# EasyEDA Pro project ProPrj_tang25k_YT8531C_V2.0_2026-08-23.epro, schematic DC12DC5
Board Name: DC12DC5; Create Date: 2025-06-27; Page Name: P1; Project Name: tang25k_YT8531C_V2.0; Schematic Name: DC12DC5; Update Date: 2025-06-27; Company: EasyEDA.com; Page Size: A4; Version: V1.0
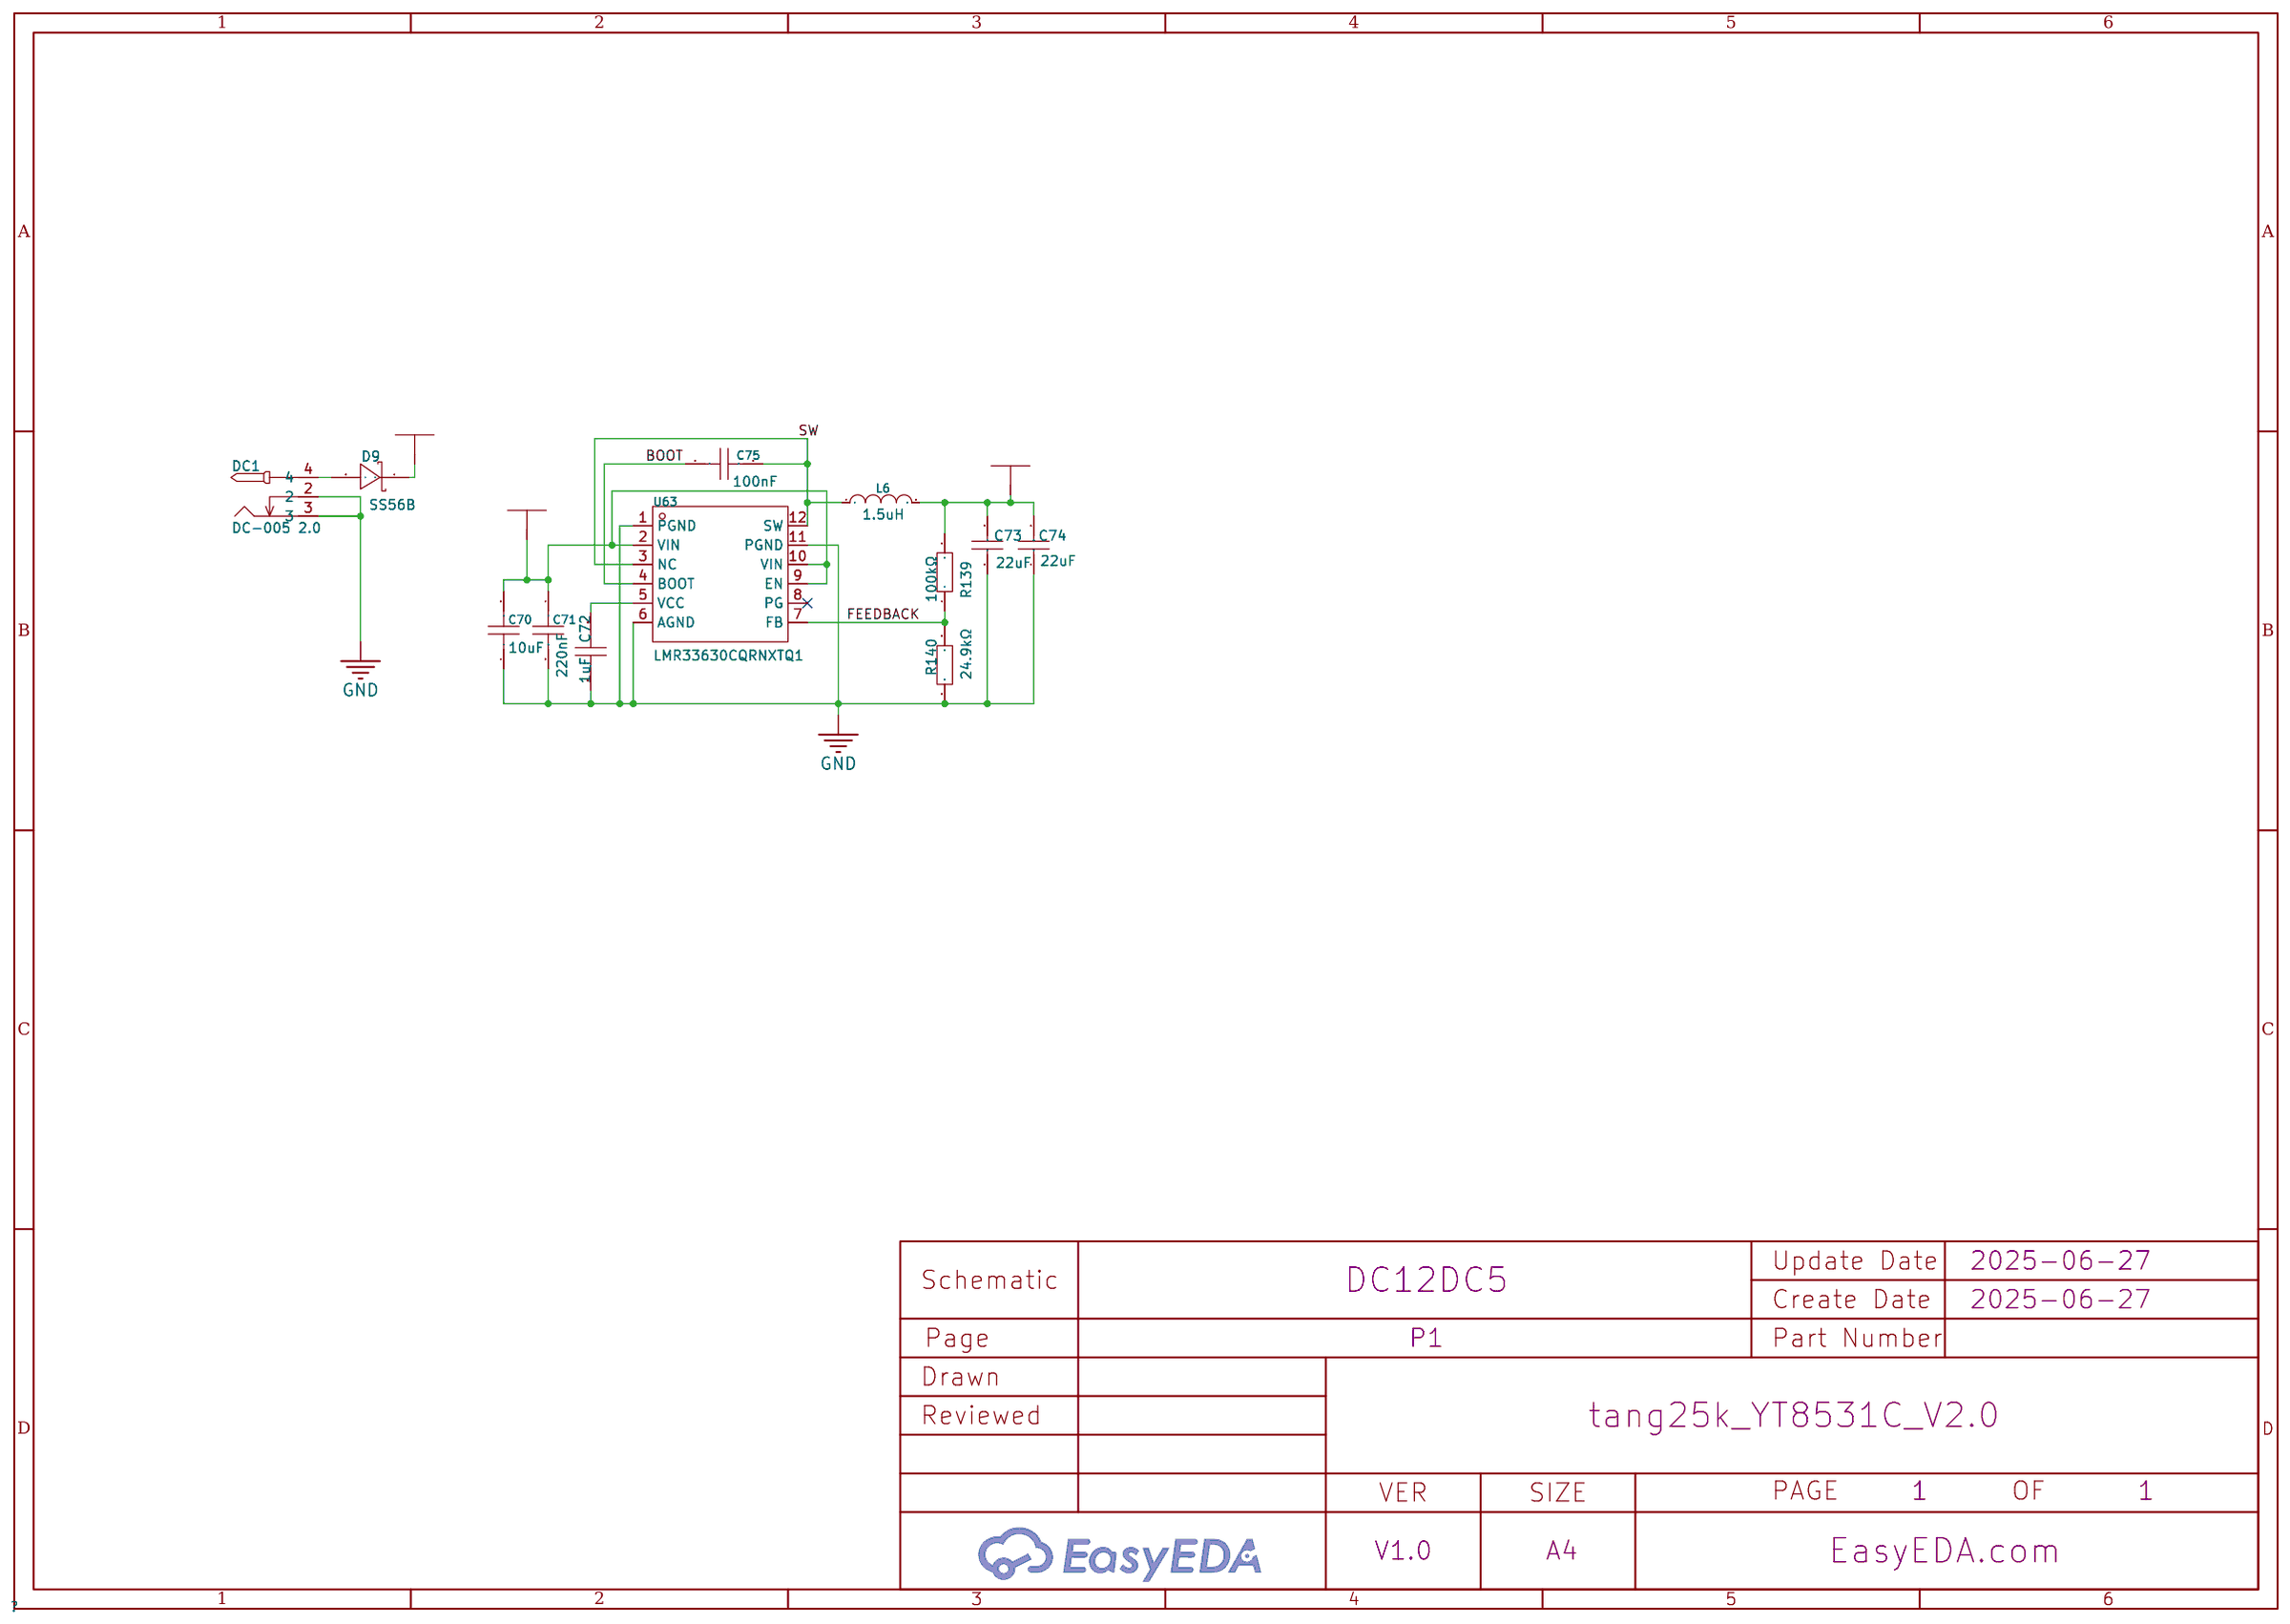
[diagram p0: schematic sheet]

## Parts
C70  10uF  [C0805]
C71  220nF  [C0603]
C72  1uF  [C0603]
C73  22uF  [C0805]
C74  22uF  [C0805]
C75  100nF  [C0603]
D9  SS56B  [SMB_L4.6-W3.6-LS5.3-RD]
DC1  DC-005 2.0  [DC-IN-TH_DC-5520-1]
L6  1.5uH  [IND-SMD_L7.2-W6.6_GPSR0730]
R139  100kΩ  [R0603]
R140  24.9kΩ  [R0603]
U63  LMR33630CQRNXTQ1  [VQFN-12_L3.0-W2.0-P0.65-BL_TI_RNX]

## Library data of the parts
C70 = GRM21BR61H106KE43L: Capacitance: Tolerance:±10% Tolerance:±10% Voltage Rated: Temperature Coefficient:; LCSC Part Name: 10uF ±10% 50V; Supplier Part: C440198; Manufacturer: muRata(村田); Supplier Footprint: 0805; JLCPCB Part Class: Basic Part; Datasheet: https://atta.szlcsc.com/upload/public/pdf/source/20230811/95AAE0C9AF55EDC31B7A4D8B733F534E.pdf; Supplier: LCSC; Tolerance: ±10%
C71 = TCC0603X7R224K500CT: Capacitance:220nF Tolerance:±10% Tolerance:±10% Voltage Rated: Temperature Coefficient:; LCSC Part Name: 220nF ±10% 50V; Supplier Part: C344195; Manufacturer: CCTC(三环); Supplier Footprint: 0603; JLCPCB Part Class: Extended Part; Datasheet: https://atta.szlcsc.com/upload/public/pdf/source/20191203/C466239_F62A586702D44EEA1C39B32FC8662B21.pdf; Supplier: LCSC; Tolerance: ±10%
C72 = CL10A105KB8NNNC: Capacitance: Tolerance:±10% Tolerance:±10% Voltage Rated: Temperature Coefficient:; LCSC Part Name: 1uF ±10% 50V; Supplier Part: C15849; Manufacturer: SAMSUNG(三星); Supplier Footprint: 0603; JLCPCB Part Class: Basic Part; Datasheet: https://atta.szlcsc.com/upload/public/pdf/source/20160103/1457707679084.pdf; Supplier: LCSC; Tolerance: ±10%
C73 C74 = CL21A226MOQNNNE: Capacitance: Tolerance:±20% Tolerance:±20% Voltage Rated: Temperature Coefficient:; LCSC Part Name: 22uF ±20% 16V; Supplier Part: C98190; Manufacturer: SAMSUNG(三星); Supplier Footprint: 0805; JLCPCB Part Class: Extended Part; Datasheet: https://atta.szlcsc.com/upload/public/pdf/source/20160218/1457707763339.pdf; Supplier: LCSC; Tolerance: ±20%
C75 = CC0603KRX7R9BB104: Capacitance: Tolerance:±10% Tolerance:±10% Voltage Rated: Temperature Coefficient:; LCSC Part Name: 100nF ±10% 50V; Supplier Part: C14663; Manufacturer: YAGEO(国巨); Supplier Footprint: 0603; JLCPCB Part Class: Basic Part; Datasheet: https://atta.szlcsc.com/upload/public/pdf/source/20180910/C282072_33301C7F631E79921B82A8DAC6BCC5B3.pdf; Supplier: LCSC; Tolerance: ±10%
D9 = SS56B_C14651: Diode Configuration:Single Forward Voltage (Vf@If):700mV@5A Reverse Voltage (Vr):60V Rectified Current:5A Reverse Leakage Current (Ir):300uA@60V; LCSC Part Name: 电压:60V 电流:5A; Supplier Part: C14651; Manufacturer: MDD(辰达半导体); Supplier Footprint: SMB(DO-214AA); JLCPCB Part Class: Extended Part; Datasheet: https://atta.szlcsc.com/upload/public/pdf/source/20230314/2C84F4C7E7966E0395BFB33DAC42B424.pdf; Supplier: LCSC; Diode Configuration: Single; Forward Voltage (Vf@If): 700mV@5A; Reverse Voltage (Vr): 60V; Rectified Current: 5A; Reverse Leakage Current (Ir): 300uA@60V
DC1 = DC-005 2.0: Connector Type:DC Power Receptacle Mounting Style:Bend insert Inside Contact Diameter:2mm Outside Contact Diameter:6.4mm Current Rating (Max):1A Voltage Rating (Max):12V Operating Temperature Range:-25℃~+85℃ Operating Temperature Range:-25℃~+85℃; LCSC Part Name: DC电源插座 内径:2mm 外径:6.4mm; Supplier Part: C16214; Manufacturer: BOOMELE(博穆精密); Supplier Footprint: 插件; JLCPCB Part Class: Extended Part; Datasheet: https://atta.szlcsc.com/upload/public/pdf/source/20230822/A395081E7D04348211A5D528B2AFD8E0.pdf; Supplier: LCSC; Connector Type: DC Power Receptacle; Mounting Style: Bend insert; Inside Contact Diameter: 2mm; Outside Contact Diameter: 6.4mm; Current Rating (Max): 1A; Voltage Rating (Max): 12V; Operating Temperature Range: -25℃~+85℃
L6 = CYA0630-1.5UH: Inductance: Tolerance:±20% Tolerance:±20% Rated Current: DC Resistance (DCR):10.6mΩ; LCSC Part Name: 1.5uH ±20%; Supplier Part: C5189745; Manufacturer: SHOU HAN(首韩); Supplier Footprint: SMD,7.2x6.6mm; JLCPCB Part Class: Extended Part; Datasheet: https://atta.szlcsc.com/upload/public/pdf/source/20221010/675719433B9E3D3FC80E9247602C1BF9.pdf; Supplier: LCSC; Tolerance: ±20%; DC Resistance (DCR): 10.6mΩ
R139 = 0603WAF1003T5E: Type:Thick Film Resistors Resistance:100kΩ Tolerance:±1% Tolerance:±1% Power(Watts): Overload Voltage (Max): Temperature Coefficient:±100ppm/℃ Temperature Coefficient:±100ppm/℃ Operating Temperature Range:-55℃~+155℃ Operating Temperature Range:-55℃~+155℃; LCSC Part Name: 100kΩ ±1% 100mW 厚膜电阻; Supplier Part: C25803; Manufacturer: UNI-ROYAL(厚声); Supplier Footprint: 0603; JLCPCB Part Class: Basic Part; Datasheet: https://atta.szlcsc.com/upload/public/pdf/source/20200306/C422600_1E6D84923E4A46A82E41ADD87F860B5C.pdf; Supplier: LCSC; Type: Thick Film Resistors; Tolerance: ±1%; Temperature Coefficient: ±100ppm/℃; Operating Temperature Range: -55℃~+155℃
R140 = 0603WAF2492T5E: Type:Thick Film Resistors Resistance:24.9kΩ Tolerance:±1% Tolerance:±1% Power(Watts): Overload Voltage (Max): Temperature Coefficient:±100ppm/℃ Temperature Coefficient:±100ppm/℃ Operating Temperature Range:-55℃~+155℃ Operating Temperature Range:-55℃~+155℃; LCSC Part Name: 24.9kΩ ±1% 100mW 厚膜电阻; Supplier Part: C25962; Manufacturer: UNI-ROYAL(厚声); Supplier Footprint: 0603; JLCPCB Part Class: Extended Part; Datasheet: https://atta.szlcsc.com/upload/public/pdf/source/20200306/C422600_1E6D84923E4A46A82E41ADD87F860B5C.pdf; Supplier: LCSC; Type: Thick Film Resistors; Tolerance: ±1%; Temperature Coefficient: ±100ppm/℃; Operating Temperature Range: -55℃~+155℃
U63 = LMR33630ARNXR: Supplier Part: C2070945; Manufacturer: TI(德州仪器); Supplier Footprint: VQFN-12(2x3); JLCPCB Part Class: Extended Part; Datasheet: https://www.ti.com/cn/lit/gpn/lmr33630; Supplier: LCSC

## Nets
GND: C70.1 C71.2 C72.2 C73.1 C74.1 DC1.2 DC1.3 R140.1 U63.1(PGND) U63.6(AGND) U63.11(PGND)
VCC5: C73.2 C74.2 L6.2 R139.2
VCC12: C70.2 C71.1 D9.1(K) U63.2(VIN) U63.9(EN) U63.10(VIN)
BOOT: C75.1 U63.4(BOOT)
FEEDBACK: R139.1 R140.2 U63.7(FB)
SW: C75.2 L6.1 U63.3(NC) U63.12(SW)
$1N450: C72.1 U63.5(VCC)
$1N552: D9.2(A) DC1.4

Not connected (* = marked no-connect by the designer): U63 8(PG)*
